# EasyEDA schematic Schematic.json
TITLE: New Schematic; REV: 1.0; Date: 2018-04-29; Sheet: 1/1; Drawn By: ridvanaltun
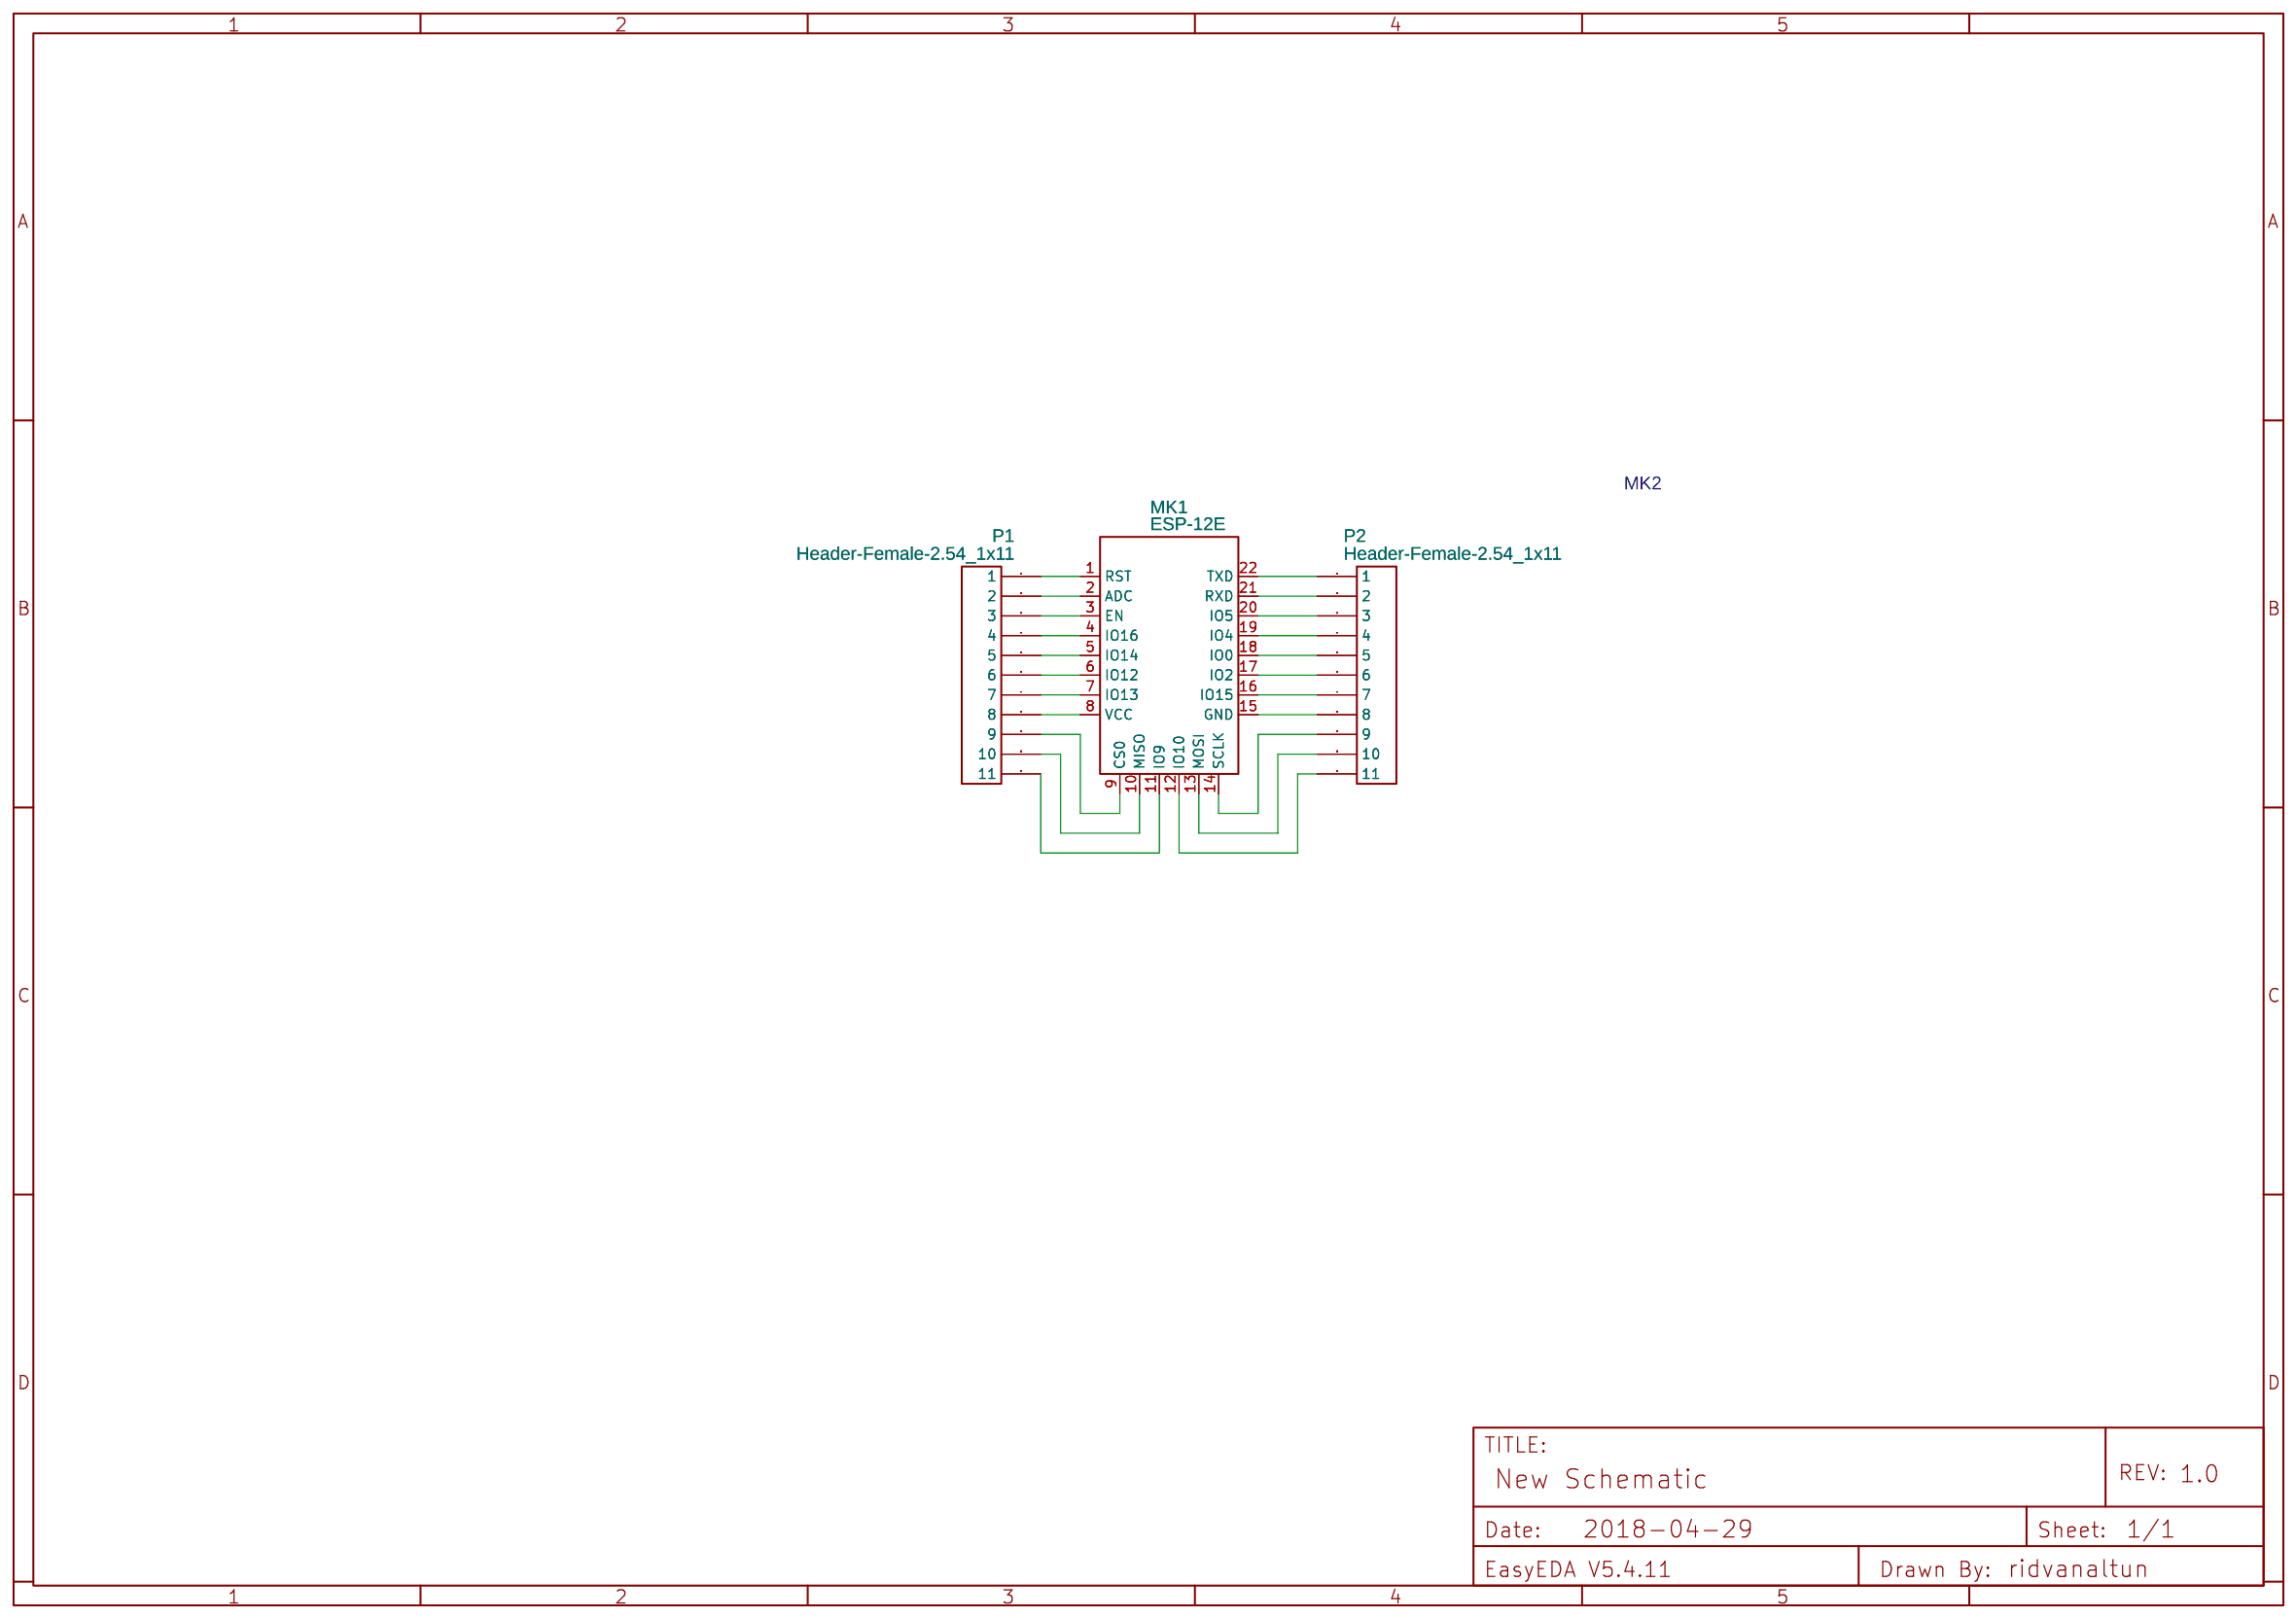
[diagram p0: schematic sheet]

## Parts
MK1  ESP-12E  [ESP-12]
P1  Header-Female-2.54_1x11  [1X11/2.54 PIN HEADER]
P2  Header-Female-2.54_1x11  [1X11/2.54 PIN HEADER]

## Library data of the parts
MK1 = -: Supplier: LCSC; Manufacturer: Ai-Thinker; LCSC: C89297
P1 P2 = -: Supplier: LCSC; Manufacturer: LCSC; Manufacturer Part: Header-Female-2.54_1x10

## Nets
Net-(MK1-1): MK1.1(RST) P1.1
Net-(MK1-2): MK1.2(ADC) P1.2
Net-(MK1-3): MK1.3(EN) P1.3
Net-(MK1-4): MK1.4(IO16) P1.4
Net-(MK1-5): MK1.5(IO14) P1.5
Net-(MK1-6): MK1.6(IO12) P1.6
Net-(MK1-7): MK1.7(IO13) P1.7
Net-(MK1-8): MK1.8(VCC) P1.8
Net-(MK1-9): MK1.9(CS0) P1.9
Net-(MK1-10): MK1.10(MISO) P1.10
Net-(MK1-11): MK1.11(IO9) P1.11
Net-(MK1-12): MK1.12(IO10) P2.11
Net-(MK1-13): MK1.13(MOSI) P2.10
Net-(MK1-14): MK1.14(SCLK) P2.9
Net-(MK1-15): MK1.15(GND) P2.8
Net-(MK1-16): MK1.16(IO15) P2.7
Net-(MK1-17): MK1.17(IO2) P2.6
Net-(MK1-18): MK1.18(IO0) P2.5
Net-(MK1-19): MK1.19(IO4) P2.4
Net-(MK1-20): MK1.20(IO5) P2.3
Net-(MK1-21): MK1.21(RXD) P2.2
Net-(MK1-22): MK1.22(TXD) P2.1

## Notes on the sheet
- MK2
